# Altium schematic sheet Sheet1.SchDoc
size Legal
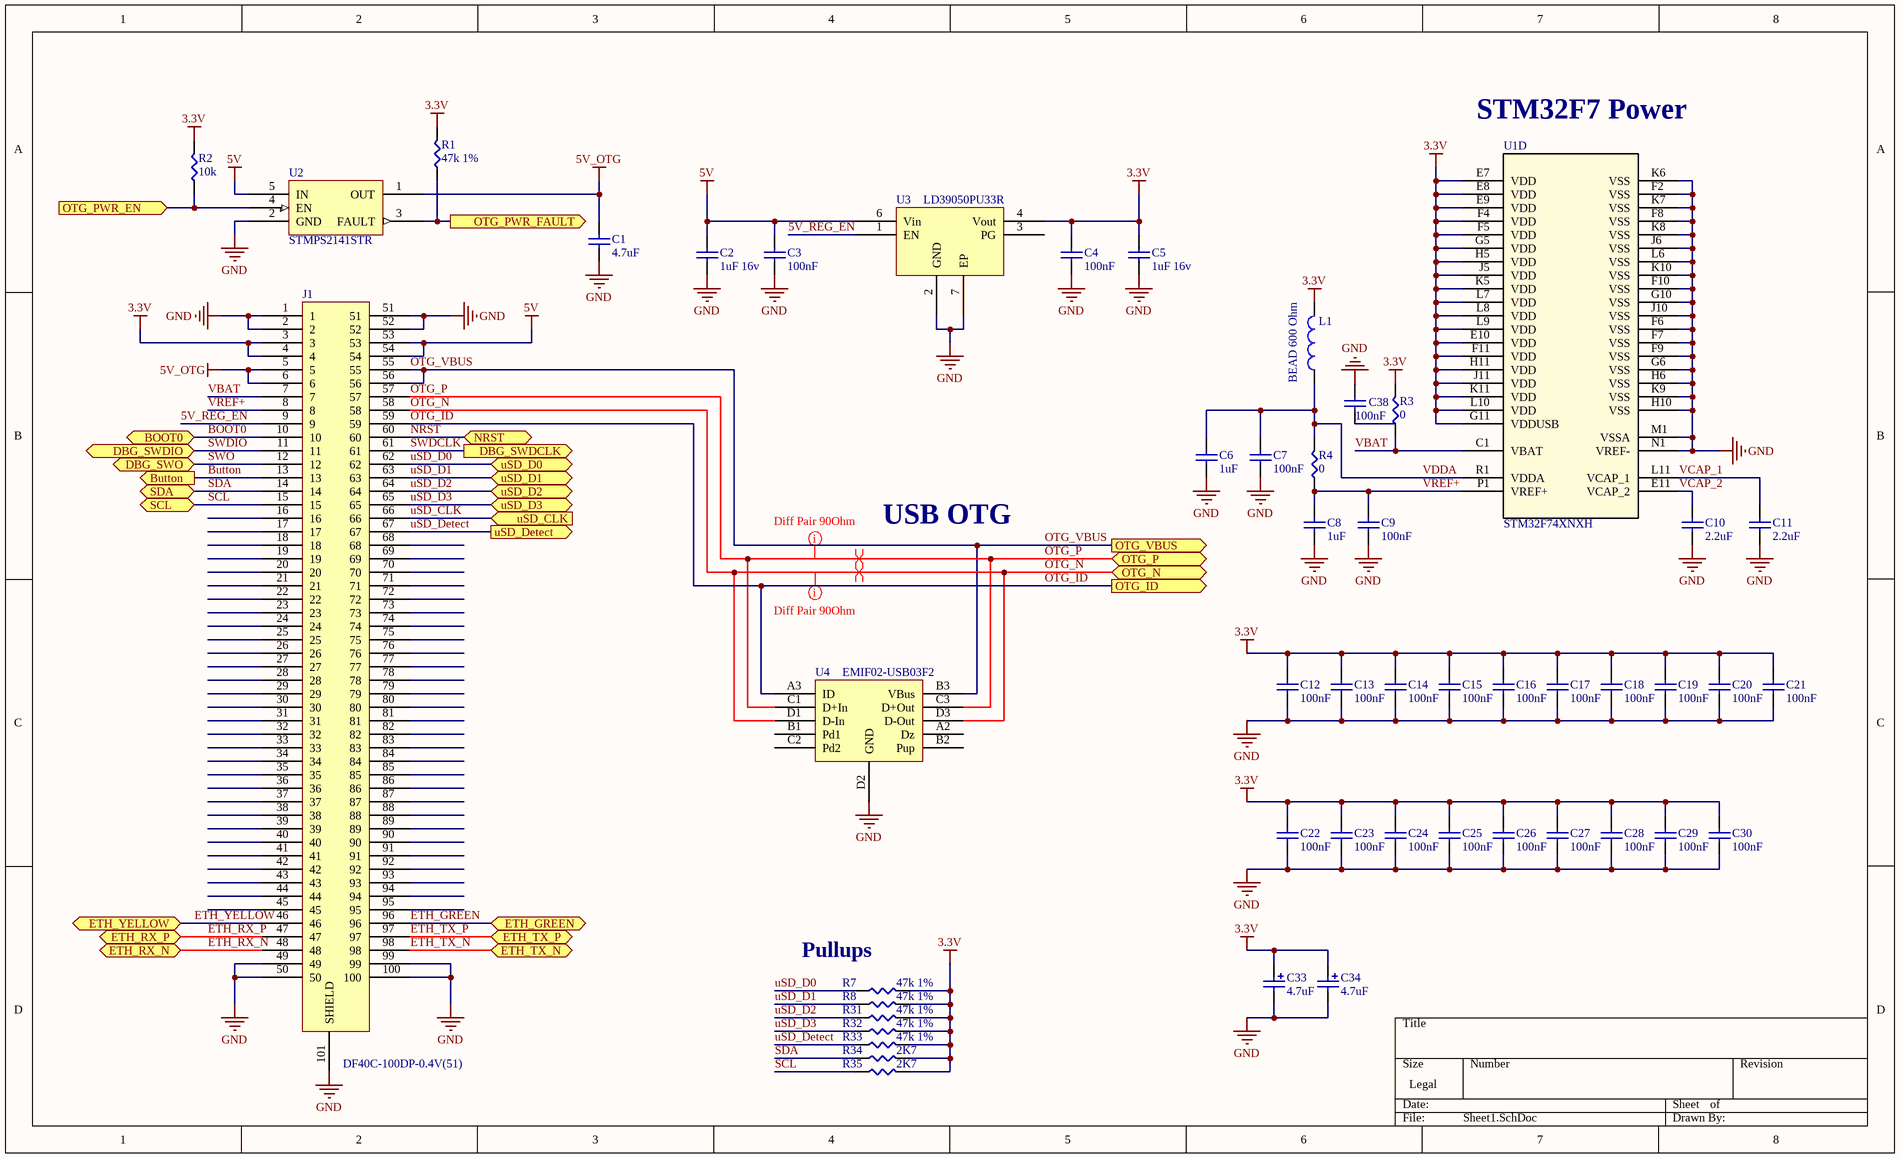
[diagram p0: Sheet1.SchDoc]

## Parts
C1  4.7uF  [CAP0603X055M]
C2  1uF 16v  [CAP0603X055M]
C3  100nF  [CAP0402X04M]
C4  100nF  [CAP0402X04M]
C5  1uF 16v  [CAP0603X055M]
C6  1uF  [CAP0402X04M]
C7  100nF  [CAP0402X04M]
C8  1uF  [CAP0402X04M]
C9  100nF  [CAP0402X04M]
C10  2.2uF  [CAP0402X04ROUND]
C11  2.2uF  [CAP0402X04ROUND]
C12  100nF  [CAP0402X04ROUND]
C13  100nF  [CAP0402X04ROUND]
C14  100nF  [CAP0402X04ROUND]
C15  100nF  [CAP0402X04ROUND]
C16  100nF  [CAP0402X04ROUND]
C17  100nF  [CAP0402X04ROUND]
C18  100nF  [CAP0402X04ROUND]
C19  100nF  [CAP0402X04ROUND]
C20  100nF  [CAP0402X04ROUND]
C21  100nF  [CAP0402X04ROUND]
C22  100nF  [CAP0402X04ROUND]
C23  100nF  [CAP0402X04ROUND]
C24  100nF  [CAP0402X04ROUND]
C25  100nF  [CAP0402X04ROUND]
C26  100nF  [CAP0402X04ROUND]
C27  100nF  [CAP0402X04ROUND]
C28  100nF  [CAP0402X04ROUND]
C29  100nF  [CAP0402X04ROUND]
C30  100nF  [CAP0402X04ROUND]
C33  4.7uF  [CAPPOL0805X07N]
C34  4.7uF  [CAPPOL0805X07N]
C38  100nF  [CAP0402X04M]
J1  DF40C-100DP-0.4V(51)  [DF40C-100DP-0.4V(51)]
L1  BEAD 600 Ohm  [IND0603X055M]
R1  47k 1%  [RES0402X04M]
R2  10k  [RES0402X04M]
R3  0  [RES0805X07M]
R4  0  [RES0805X07M]
R7  47k 1%  [RES0402X04M]
R8  47k 1%  [RES0402X04M]
R31  47k 1%  [RES0402X04M]
R32  47k 1%  [RES0402X04M]
R33  47k 1%  [RES0402X04M]
R34  2K7  [RES0402X04M]
R35  2K7  [RES0402X04M]
U1  STM32F74XNXH  [TFBGA-216_13X13]  (part D of 5)
U2  STMPS2141STR  [SOT95P280X145-5N]
U3  LD39050PU33R  [LD39050]
U4  EMIF02-USB03F2  [EMIF02-USB03F2]

## Ports
BOOT0 (bidir), Button (out), DBG_SWDCLK (out), DBG_SWDIO (bidir), DBG_SWO (bidir), ETH_GREEN (bidir), ETH_RX_N (bidir), ETH_RX_P (bidir), ETH_TX_N (bidir), ETH_TX_P (bidir), ETH_YELLOW (bidir), NRST (bidir), OTG_ID (out), OTG_N (bidir), OTG_P (bidir), OTG_PWR_EN (in), OTG_PWR_FAULT (out), OTG_VBUS (out), SCL (bidir), SDA (bidir), uSD_CLK (in), uSD_D0 (bidir), uSD_D1 (bidir), uSD_D2 (bidir), uSD_D3 (bidir), uSD_Detect (out)

## Nets
3.3V: C4.2 C5.2 C12.2 C13.2 C14.2 C15.2 C16.2 C17.2 C18.2 C19.2 C20.2 C21.2 C22.2 C23.2 C24.2 C25.2 C26.2 C27.2 C28.2 C29.2 C30.2 C33.1 C34.1 J1.3 J1.4 L1.2 R1.2 R2.2 R3.2 R7.2 R8.2 R31.2 R32.2 R33.2 R34.2 R35.2 U1.E7(VDD) U1.E8(VDD) U1.E9(VDD) U1.E10(VDD) U1.F4(VDD) U1.F5(VDD) U1.F11(VDD) U1.G5(VDD) U1.G11(VDDUSB) U1.H5(VDD) U1.H11(VDD) U1.J5(VDD) U1.J11(VDD) U1.K5(VDD) U1.K11(VDD) U1.L7(VDD) U1.L8(VDD) U1.L9(VDD) U1.L10(VDD) U3.4(Vout)
5V: C2.2 C3.2 J1.53 J1.54 U2.5(IN) U3.6(Vin)
5V_OTG: C1.2 J1.5 J1.6 U2.1(OUT)
GND: C1.1 C2.1 C3.1 C4.1 C5.1 C6.1 C7.1 C8.1 C9.1 C10.1 C11.1 C12.1 C13.1 C14.1 C15.1 C16.1 C17.1 C18.1 C19.1 C20.1 C21.1 C22.1 C23.1 C24.1 C25.1 C26.1 C27.1 C28.1 C29.1 C30.1 C33.2 C34.2 C38.2 J1.1 J1.2 J1.49 J1.50 J1.51 J1.52 J1.99 J1.100 J1.101(SHIELD) U1.F2(VSS) U1.F6(VSS) U1.F7(VSS) U1.F8(VSS) U1.F9(VSS) U1.F10(VSS) U1.G6(VSS) U1.G10(VSS) U1.H6(VSS) U1.H10(VSS) U1.J6(VSS) U1.J10(VSS) U1.K6(VSS) U1.K7(VSS) U1.K8(VSS) U1.K9(VSS) U1.K10(VSS) U1.L6(VSS) U1.M1(VSSA) U1.N1(VREF-) U2.2(GND) U3.2(GND) U3.7(EP) U4.D2(GND)
5V_REG_EN: J1.9 U3.1(EN)
BOOT0: J1.10 ; port BOOT0
Button: J1.13 ; port Button
ETH_GREEN: J1.96 ; port ETH_GREEN
ETH_RX_N: J1.48 ; port ETH_RX_N
ETH_RX_P: J1.47 ; port ETH_RX_P
ETH_TX_N: J1.98 ; port ETH_TX_N
ETH_TX_P: J1.97 ; port ETH_TX_P
ETH_YELLOW: J1.46 ; port ETH_YELLOW
NRST: J1.60 ; port NRST
OTG_ID: J1.59 U4.A3(ID) ; port OTG_ID
OTG_N: J1.58 U4.D1(D-In) U4.D3(D-Out) ; port OTG_N
OTG_P: J1.57 U4.C1(D+In) U4.C3(D+Out) ; port OTG_P
OTG_PWR_EN: R2.1 U2.4(EN) ; port OTG_PWR_EN
OTG_PWR_FAULT: R1.1 U2.3(FAULT) ; port OTG_PWR_FAULT
OTG_VBUS: J1.55 J1.56 U4.B3(VBus) ; port OTG_VBUS
SCL: J1.15 R35.1 ; port SCL
SDA: J1.14 R34.1 ; port SDA
SWDCLK: J1.61 ; port DBG_SWDCLK
SWDIO: J1.11 ; port DBG_SWDIO
SWO: J1.12 ; port DBG_SWO
uSD_CLK: J1.66 ; port uSD_CLK
uSD_D0: J1.62 R7.1 ; port uSD_D0
uSD_D1: J1.63 R8.1 ; port uSD_D1
uSD_D2: J1.64 R31.1 ; port uSD_D2
uSD_D3: J1.65 R32.1 ; port uSD_D3
uSD_Detect: J1.67 R33.1 ; port uSD_Detect
VBAT: J1.7 R3.1 U1.C1(VBAT)
VCAP_1: C11.2 U1.L11(VCAP_1)
VCAP_2: C10.2 U1.E11(VCAP_2)
VDDA: C6.2 C7.2 L1.1 R4.2 U1.R1(VDDA)
VREF+: C8.2 C9.2 J1.8 R4.1 U1.P1(VREF+)

Not connected (* = marked no-connect by the designer): C38 1; J1 16 17 18 19 20 21 22 23 24 25 26 27 28 29 30 31 32 33 34 35 36 37 38 39 40 41 42 43 44 45 68 69 70 71 72 73 74 75 76 77 78 79 80 81 82 83 84 85 86 87 88 89 90 91 92 93 94 95; U3 3(PG); U4 A2(Dz) B1(Pd1) B2(Pup) C2(Pd2)

## Layout directives
differential pair: OTG_N, OTG_P
DiffPair90: Undefined: OTG_N, OTG_P

## Notes on the sheet
- STM32F7 Power
- USB OTG
- Pullups

## Library data of the parts
C1 = CL10A475MP5LNNC: CAP CER 4.7UF 10V X5R 0603; Manufacturer: Samsung Electro-Mechanics America, Inc.; Capacitance: 4.7µF; Tolerance: ±20%; Supplier 1: Digi-Key; Manufacturer Part Number: CL10A475MP5LNNC; RoHS: RoHS Compliant; Category: Capacitors; Stock 1: 31898; Pricing 1: 1=0.1, 10=0.074, 25=0.0544, 50=0.0422, 100=0.0349, 250=0.02892, 500=0.0245, 1000=0.02028 (USD); Packaging: Cut Tape (CT); Part Status: Active; Voltage - Rated: 10V; Temperature Coefficient: X5R; Operating Temperature: -55°C ~ 85°C; Features: Low Profile; Ratings: -; Applications: General Purpose; Failure Rate: *; Mounting Type: Surface Mount, MLCC; Package / Case: 0603 (1608 Metric); Size / Dimension: 0.063" L x 0.031" W (1.60mm x 0.80mm); Height - Seated (Max): -; Thickness (Max): 0.022" (0.55mm); Lead Spacing: -; Lead Style: -; ComponentLink1URL: http://www.samsungsem.com/kr/support/library/product-catalog/__icsFiles/afieldfile/2016/09/27/MLCC.pdf; ComponentLink1Description: http://www.samsungsem.com/kr/support/library/product-catalog/__icsFiles/afieldfile/2016/09/27/MLCC.pdf; Supplier Part Number 1: 1276-6684-1-ND
C2 C5 = CC0603ZRY5V7BB105: CAP CER 1UF 16V Y5V 0603; Manufacturer: Yageo; Capacitance: 1µF; Tolerance: -20%, +80%; Temperature Coefficient: Y5V (F); Supplier 1: Digi-Key; Manufacturer Part Number: CC0603ZRY5V7BB105; RoHS: RoHS Compliant; Category: Capacitors; Stock 1: 840235; Pricing 1: 1=0.1, 10=0.033, 25=0.0236, 100=0.0152, 250=0.01248, 500=0.01068, 1000=0.00832 (USD); Packaging: Cut Tape (CT); Part Status: Active; Voltage - Rated: 16V; Operating Temperature: -30°C ~ 85°C; Features: -; Ratings: -; Applications: General Purpose; Failure Rate: -; Mounting Type: Surface Mount, MLCC; Package / Case: 0603 (1608 Metric); Size / Dimension: 0.063" L x 0.031" W (1.60mm x 0.80mm); Height - Seated (Max): -; Thickness (Max): 0.035" (0.90mm); Lead Spacing: -; Lead Style: -; ComponentLink1URL: http://www.yageo.com/documents/recent/UPY-GPHC_Y5V_6.3V-to-50V_6.pdf; ComponentLink1Description: http://www.yageo.com/documents/recent/UPY-GPHC_Y5V_6.3V-to-50V_6.pdf; Supplier Part Number 1: 311-1372-1-ND
C3 C4 C7 C9 C12-C30 C38 = GRM155R71C104KA88J: CAP CER 0.1UF 16V X7R 0402; Manufacturer: Murata Electronics North America; Capacitance: 0.10µF; Tolerance: ±10%; Supplier 1: Digi-Key; Manufacturer Part Number: GRM155R71C104KA88J; RoHS: RoHS Compliant; Category: Capacitors; Stock 1: 28696221; Pricing 1: 1=0.1, 10=0.012, 50=0.0066, 100=0.0055, 250=0.00452, 500=0.00386, 1000=0.003, 5000=0.0025, 10000=0.0023 (USD); Packaging: Cut Tape (CT); Part Status: Active; Voltage - Rated: 16V; Temperature Coefficient: X7R; Operating Temperature: -55°C ~ 125°C; Features: -; Ratings: -; Applications: General Purpose; Failure Rate: *; Mounting Type: Surface Mount, MLCC; Package / Case: 0402 (1005 Metric); Size / Dimension: 0.039" L x 0.020" W (1.00mm x 0.50mm); Height - Seated (Max): -; Thickness (Max): 0.022" (0.55mm); Lead Spacing: -; Lead Style: *; ComponentLink1URL: http://www.murata.com/~/media/webrenewal/support/library/catalog/products/capacitor/mlcc/c02e.pdf; ComponentLink1Description: http://www.murata.com/~/media/webrenewal/support/library/catalog/products/capacitor/mlcc/c02e.pdf; Supplier Part Number 1: 490-6328-1-ND
C6 C8 = GRM155R60J105KE19D: CAP CER 1UF 6.3V X5R 0402; Manufacturer: Murata Electronics North America; Capacitance: 1µF; Tolerance: ±10%; Supplier 1: Digi-Key; Manufacturer Part Number: GRM155R60J105KE19D; RoHS: RoHS Compliant; Category: Capacitors; Stock 1: 3970482; Pricing 1: 1=0.1, 10=0.021, 50=0.0114, 100=0.0096, 250=0.00784, 500=0.0067, 1000=0.00522, 5000=0.00435 (USD); Packaging: Cut Tape (CT); Part Status: Active; Voltage - Rated: 6.3V; Temperature Coefficient: X5R; Operating Temperature: -55°C ~ 85°C; Features: -; Ratings: -; Applications: General Purpose; Failure Rate: *; Mounting Type: Surface Mount, MLCC; Package / Case: 0402 (1005 Metric); Size / Dimension: 0.039" L x 0.020" W (1.00mm x 0.50mm); Height - Seated (Max): -; Thickness (Max): 0.022" (0.55mm); Lead Spacing: -; Lead Style: -; ComponentLink1URL: http://www.murata.com/~/media/webrenewal/support/library/catalog/products/capacitor/mlcc/c02e.pdf; ComponentLink1Description: http://www.murata.com/~/media/webrenewal/support/library/catalog/products/capacitor/mlcc/c02e.pdf; Supplier Part Number 1: 490-1320-1-ND
C10 C11 = 04026D225KAT2A: CAP CER 2.2UF 6.3V X5R 0402; Manufacturer: AVX Corporation; Capacitance: 2.2µF; Tolerance: ±10%; Supplier 1: Digi-Key; Manufacturer Part Number: 04026D225KAT2A; RoHS: RoHS Compliant; Category: Capacitors; Stock 1: 639807; Pricing 1: 1=0.1, 10=0.075, 25=0.0544, 50=0.0424, 100=0.0351, 250=0.029, 500=0.02458, 1000=0.02035, 5000=0.01733 (USD); Packaging: Cut Tape (CT); Part Status: Active; Voltage - Rated: 6.3V; Temperature Coefficient: X5R; Operating Temperature: -55°C ~ 85°C; Features: -; Ratings: -; Applications: General Purpose; Failure Rate: *; Mounting Type: Surface Mount, MLCC; Package / Case: 0402 (1005 Metric); Size / Dimension: 0.039" L x 0.020" W (1.00mm x 0.50mm); Height - Seated (Max): -; Thickness (Max): 0.022" (0.56mm); Lead Spacing: -; Lead Style: -; ComponentLink1URL: http://datasheets.avx.com/cx5r.pdf; ComponentLink1Description: http://datasheets.avx.com/cx5r.pdf; Supplier Part Number 1: 478-7885-1-ND
C33 C34 = F921A475MPA: CAP TANT 4.7UF 10V 20% 0805; Manufacturer: AVX Corporation; Manufacturer Size Code: P; Capacitance: 4.7µF; Type: Molded; ESR (Equivalent Series Resistance): 6 Ohm; Supplier 1: Digi-Key; Manufacturer Part Number: F921A475MPA; RoHS: RoHS Compliant; Category: Capacitors; Stock 1: 10365; Pricing 1: 1=0.29, 10=0.204, 25=0.1672, 50=0.1426, 100=0.1223, 250=0.10192, 500=0.09174, 1000=0.07746 (USD); Packaging: Cut Tape (CT); Part Status: Active; Tolerance: ±20%; Voltage - Rated: 10V; Operating Temperature: -55°C ~ 125°C; Lifetime @ Temp.: -; Mounting Type: Surface Mount; Package / Case: 0805 (2012 Metric); Size / Dimension: 0.079" L x 0.049" W (2.00mm x 1.25mm); Height - Seated (Max): 0.039" (1.00mm); Lead Spacing: -; Features: General Purpose; Failure Rate: -; ComponentLink1URL: http://datasheets.avx.com/f92.pdf; ComponentLink1Description: http://datasheets.avx.com/f92.pdf; Supplier Part Number 1: 478-8125-1-ND
J1 = DF40C-100DP-0.4V(51): CONN HDR 100POS 0.4MM SMD GOLD; Manufacturer: Hirose Electric Co Ltd; Connector Type: Plug, Outer Shroud Contacts; Number of Positions: 100; Pitch: 0.016" (0.40mm); Mated Stacking Heights: 1.5mm, 2mm, 2.5mm, 3mm, 3.5mm, 4mm; Supplier 1: Digi-Key; Manufacturer Part Number: DF40C-100DP-0.4V(51); RoHS: RoHS Compliant; Category: Connectors, Interconnects; Stock 1: 15710; Pricing 1: 1=1.66, 10=1.509, 25=1.4168, 50=1.3552, 100=1.2936, 250=1.1704, 500=1.078, 1000=0.924, 2500=0.8624 (USD); Packaging: Cut Tape (CT); Part Status: Active; Number of Rows: 2; Mounting Type: Surface Mount; Features: Solder Retention; Contact Finish: Gold; Contact Finish Thickness: 2µin (0.05µm); Height Above Board: 0.045" (1.14mm); ComponentLink1URL: https://www.hirose.com/product/download/?distributor=digikey&type=2d&lang=en&num=DF40C-100DP-0.4V(51); ComponentLink1Description: https://www.hirose.com/product/download/?distributor=digikey&type=2d&lang=en&num=DF40C-100DP-0.4V(51); Supplier Part Number 1: H11614CT-ND
L1 = BK1608HW601-T: FERRITE BEAD 600 OHM 0603 1LN; Manufacturer: Taiyo Yuden; Number of Lines: 1; Impedance @ Frequency: 600 Ohm @ 100MHz; Current Rating (Max): 300mA; DC Resistance (DCR) (Max): 400 mOhm; Supplier 1: Digi-Key; Manufacturer Part Number: BK1608HW601-T; RoHS: RoHS Compliant; Category: Filters; Stock 1: 46168; Pricing 1: 1=0.1, 10=0.059, 50=0.0474, 100=0.0426, 250=0.0312, 500=0.0227, 1000=0.02223 (USD); Packaging: Cut Tape (CT); Part Status: Active; Filter Type: -; Ratings: -; Operating Temperature: -55°C ~ 125°C; Package / Case: 0603 (1608 Metric); Mounting Type: Surface Mount; Height (Max): 0.037" (0.95mm); Size / Dimension: 0.063" L x 0.031" W (1.60mm x 0.80mm); ComponentLink1URL: http://ds.yuden.co.jp/TYCOMPAS/ut/detail.do?productNo=BK1608HW601-T&fileName=BK1608HW601-T_SS&mode=specSheetDownload; ComponentLink1Description: http://ds.yuden.co.jp/TYCOMPAS/ut/detail.do?productNo=BK1608HW601-T&fileName=BK1608HW601-T_SS&mode=specSheetDownload; Supplier Part Number 1: 587-1879-1-ND
R1 R7 R8 R31-R33 = ERJ-2RKF4702X: RES SMD 47K OHM 1% 1/10W 0402; Manufacturer: Panasonic Electronic Components; Power (Watts): 0.1W, 1/10W; Temperature Coefficient: ±100ppm/°C; Supplier 1: Digi-Key; Manufacturer Part Number: ERJ-2RKF4702X; RoHS: RoHS Compliant; Category: Resistors; Stock 1: 296471; Pricing 1: 1=0.1, 50=0.015, 100=0.011, 250=0.0084, 500=0.00674, 1000=0.00496, 5000=0.00355 (USD); Packaging: Cut Tape (CT); Part Status: Active; Resistance (Ohms): 47k; Tolerance: ±1%; Composition: Thick Film; Features: Automotive AEC-Q200; Operating Temperature: -55°C ~ 155°C; Package / Case: 0402 (1005 Metric); Supplier Device Package: 0402; Size / Dimension: 0.039" L x 0.020" W (1.00mm x 0.50mm); Height - Seated (Max): 0.016" (0.40mm); Number of Terminations: 2; Failure Rate: -; ComponentLink1URL: http://industrial.panasonic.com/www-cgi/jvcr13pz.cgi?E+PZ+3+AOA0002+ERJ2RKF4702X+7+WW; ComponentLink1Description: http://industrial.panasonic.com/www-cgi/jvcr13pz.cgi?E+PZ+3+AOA0002+ERJ2RKF4702X+7+WW; Supplier Part Number 1: P47.0KLCT-ND
R2 = RC0402FR-0710KL: RES SMD 10K OHM 1% 1/16W 0402; Manufacturer: Yageo; Power (Watts): 0.063W, 1/16W; Temperature Coefficient: ±100ppm/°C; Supplier 1: Digi-Key; Manufacturer Part Number: RC0402FR-0710KL; RoHS: RoHS Compliant; Category: Resistors; Stock 1: 13115833; Pricing 1: 1=0.1, 10=0.013, 25=0.0096, 100=0.0054, 250=0.00412, 500=0.00328, 1000=0.00242, 2500=0.0021, 5000=0.00173 (USD); Packaging: Cut Tape (CT); Part Status: Active; Resistance (Ohms): 10k; Tolerance: ±1%; Composition: Thick Film; Features: Moisture Resistant; Operating Temperature: -55°C ~ 155°C; Package / Case: 0402 (1005 Metric); Supplier Device Package: 0402; Size / Dimension: 0.039" L x 0.020" W (1.00mm x 0.50mm); Height - Seated (Max): 0.016" (0.40mm); Number of Terminations: 2; Failure Rate: -; ComponentLink1URL: http://www.yageo.com/NewPortal/yageodocoutput?fileName=/pdf/R-Chip/PYu-RC_Group_51_RoHS_L_4.pdf; ComponentLink1Description: http://www.yageo.com/NewPortal/yageodocoutput?fileName=/pdf/R-Chip/PYu-RC_Group_51_RoHS_L_4.pdf; Supplier Part Number 1: 311-10.0KLRCT-ND
R3 R4 = RC0805JR-070RL: RES SMD 0.0 OHM JUMPER 1/8W 0805; Manufacturer: Yageo; Resistance (Ohms): 0.0; Power (Watts): 0.125W, 1/8W; Supplier 1: Digi-Key; Manufacturer Part Number: RC0805JR-070RL; RoHS: RoHS Compliant; Category: Resistors; Stock 1: 2486712; Pricing 1: 1=0.1, 10=0.018, 25=0.0128, 100=0.0073, 250=0.00556, 500=0.00444, 1000=0.00326, 2500=0.00283 (USD); Packaging: Cut Tape (CT); Part Status: Active; Tolerance: Jumper; Composition: Thick Film; Features: Moisture Resistant; Temperature Coefficient: -; Operating Temperature: -55°C ~ 155°C; Package / Case: 0805 (2012 Metric); Supplier Device Package: 0805; Size / Dimension: 0.079" L x 0.049" W (2.00mm x 1.25mm); Height - Seated (Max): 0.024" (0.60mm); Number of Terminations: 2; Failure Rate: -; ComponentLink1URL: http://www.yageo.com/NewPortal/yageodocoutput?fileName=/pdf/R-Chip/PYu-RC_Group_51_RoHS_L_4.pdf; ComponentLink1Description: http://www.yageo.com/NewPortal/yageodocoutput?fileName=/pdf/R-Chip/PYu-RC_Group_51_RoHS_L_4.pdf; Supplier Part Number 1: 311-0.0ARCT-ND
R34 R35 = ERJ-2RKF2701X: RES SMD 2.7K OHM 1% 1/10W 0402; Manufacturer: Panasonic Electronic Components; Power (Watts): 0.1W, 1/10W; Temperature Coefficient: ±100ppm/°C; Supplier 1: Digi-Key; Manufacturer Part Number: ERJ-2RKF2701X; RoHS: RoHS Compliant; Category: Resistors; Stock 1: 285382; Pricing 1: 1=0.1, 50=0.015, 100=0.011, 250=0.0084, 500=0.00674, 1000=0.00496, 5000=0.00355 (USD); Packaging: Cut Tape (CT); Part Status: Active; Resistance (Ohms): 2.7k; Tolerance: ±1%; Composition: Thick Film; Features: Automotive AEC-Q200; Operating Temperature: -55°C ~ 155°C; Package / Case: 0402 (1005 Metric); Supplier Device Package: 0402; Size / Dimension: 0.039" L x 0.020" W (1.00mm x 0.50mm); Height - Seated (Max): 0.016" (0.40mm); Number of Terminations: 2; Failure Rate: -; ComponentLink1URL: http://industrial.panasonic.com/www-cgi/jvcr13pz.cgi?E+PZ+3+AOA0002+ERJ2RKF2701X+7+WW; ComponentLink1Description: http://industrial.panasonic.com/www-cgi/jvcr13pz.cgi?E+PZ+3+AOA0002+ERJ2RKF2701X+7+WW; Supplier Part Number 1: P2.70KLCT-ND
U1 = STM32F74XNXH: Imported; Manufacturer Part Number: STM32F746NGH6; Vendor: STMicroelectronics; C: Copyright (C) 2016 Accelerated Designs. All rights reserved; Core Processor: ARM® Cortex®-M7; Core Size: 32-Bit; Speed: 216MHz; Connectivity: CAN, EBI/EMI, Ethernet, I²C, IrDA, LIN, SAI, SD, SPDIF-Rx, SPI, UART/USART, USB OTG; Peripherals: Brown-out Detect/Reset, DMA, I²S, LCD, POR, PWM, WDT; Number of I/O: 168; Program Memory Size: 1MB (1M x 8); Program Memory Type: FLASH; RAM Size: 320K x 8; Voltage - Supply (Vcc/Vdd): 1.7 V ~ 3.6 V; Data Converters: A/D 24x12b, D/A 2x12b; Oscillator Type: Internal; Copyright: Copyright (C) 2016 Accelerated Designs. All rights reserved; RefDes: RefDes; Type: Type; Value: Value; Supplier 1: Digi-Key; Manufacturer: STMicroelectronics; RoHS: RoHS Compliant; Category: Integrated Circuits (ICs); Stock 1: 825; Pricing 1: 1=17.07, 10=15.687, 100=13.2486, 500=11.7856 (USD); Packaging: Tray; Part Status: Active; EEPROM Size: -; Operating Temperature: -40°C ~ 85°C (TA); Package / Case: 216-TFBGA; Supplier Device Package: 216-TFBGA (13x13); ComponentLink1Description: http://www.st.com/content/ccc/resource/technical/document/datasheet/96/ed/61/9b/e0/6c/45/0b/DM00166116.pdf/files/DM00166116.pdf/jcr:content/translations/en.DM00166116.pdf; Supplier Part Number 1: 497-15818-ND
U2 = STMPS2141STR: IC PWR SWITCH 1CH 500MA SOT23-5; Manufacturer: STMicroelectronics; Switch Type: General Purpose; Number of Outputs: 1; Ratio - Input:Output: 1:1; Output Configuration: High Side; Output Type: N-Channel; Interface: On/Off; Voltage - Load: 2.7 V ~ 5.5 V; Voltage - Supply (Vcc/Vdd): Not Required; Rds On (Typ): 90 mOhm; Input Type: Non-Inverting; Fault Protection: Current Limiting (Fixed), Over Temperature, Reverse Current, UVLO; Supplier 1: Digi-Key; Manufacturer Part Number: STMPS2141STR; RoHS: RoHS Compliant; Category: Integrated Circuits (ICs); Stock 1: 9855; Pricing 1: 1=0.61, 10=0.521, 100=0.3893, 500=0.30592, 1000=0.23639 (USD); Packaging: Cut Tape (CT); Part Status: Active; Current - Output (Max): 500mA; Features: -; Operating Temperature: -40°C ~ 125°C (TJ); Package / Case: SC-74A, SOT-753; Supplier Device Package: SOT-23-5; ComponentLink1URL: http://www.st.com/content/ccc/resource/technical/document/datasheet/e8/d7/48/25/eb/87/45/b3/CD00167470.pdf/files/CD00167470.pdf/jcr:content/translations/en.CD00167470.pdf; ComponentLink1Description: http://www.st.com/content/ccc/resource/technical/document/datasheet/e8/d7/48/25/eb/87/45/b3/CD00167470.pdf/files/CD00167470.pdf/jcr:content/translations/en.CD00167470.pdf; Supplier Part Number 1: 497-6933-1-ND
U3 = LD39050PU33R: IC REG LDO 3.3V 0.5A 6DFN; Manufacturer: STMicroelectronics; Regulator Topology: Positive Fixed; Current - Output: 500mA; Voltage - Dropout (Typical): 0.2V @ 500mA; Number of Regulators: 1; Voltage - Input: Up to 5.5V; Supplier 1: Digi-Key; Manufacturer Part Number: LD39050PU33R; RoHS: RoHS Compliant; Category: Integrated Circuits (ICs); Stock 1: 4096; Pricing 1: 1=1.07, 10=0.957, 100=0.7462, 500=0.61646, 1000=0.48668 (USD); Packaging: Cut Tape (CT); Part Status: Active; Voltage - Output: 3.3V; Current - Limit (Min): -; Operating Temperature: -40°C ~ 125°C; Mounting Type: Surface Mount; Package / Case: 6-VDFN Exposed Pad; Supplier Device Package: 6-DFN (3x3); ComponentLink1URL: http://www.st.com/content/ccc/resource/technical/document/datasheet/12/43/cc/93/21/f6/41/66/CD00227527.pdf/files/CD00227527.pdf/jcr:content/translations/en.CD00227527.pdf; ComponentLink1Description: http://www.st.com/content/ccc/resource/technical/document/datasheet/12/43/cc/93/21/f6/41/66/CD00227527.pdf/files/CD00227527.pdf/jcr:content/translations/en.CD00227527.pdf; Supplier Part Number 1: 497-8716-1-ND
U4 = EMIF02-USB03F2: FILTER RC(PI) 33 OHM/20PF SMD; Manufacturer: STMicroelectronics; Filter Order: 2nd; Number of Channels: 2; Resistance - Channel (Ohms): 33; Values: R = 33 Ohms, C = 20pF; ESD Protection: Yes; Supplier 1: Digi-Key; Manufacturer Part Number: EMIF02-USB03F2; RoHS: RoHS Compliant; Category: Filters; Stock 1: 8918; Pricing 1: 1=0.68, 10=0.644, 100=0.4574, 500=0.39502, 1000=0.35343 (USD); Packaging: Cut Tape (CT); Part Status: Active; Type: Low Pass; Technology: RC (Pi); Center / Cutoff Frequency: -; Attenuation Value: -; Current: -; Operating Temperature: -40°C ~ 85°C; Applications: USB; Voltage - Rated: -; Mounting Type: Surface Mount; Package / Case: 11-WFBGA, FCBGA; Size / Dimension: 0.076" L x 0.057" W (1.94mm x 1.44mm); Height: 0.028" (0.70mm); ComponentLink1URL: http://www.st.com/content/ccc/resource/technical/document/datasheet/0a/25/37/a6/28/ab/4f/24/CD00042880.pdf/files/CD00042880.pdf/jcr:content/translations/en.CD00042880.pdf; ComponentLink1Description: http://www.st.com/content/ccc/resource/technical/document/datasheet/0a/25/37/a6/28/ab/4f/24/CD00042880.pdf/files/CD00042880.pdf/jcr:content/translations/en.CD00042880.pdf; Supplier Part Number 1: 497-13521-1-ND